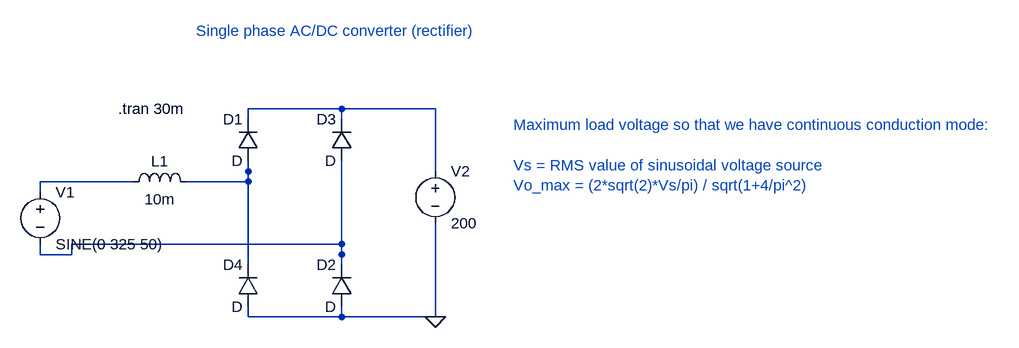
[diagram p0: schematic Single-phase-rectifier-constant-voltage-load.asc]
Single-phase-rectifier-constant-voltage-load.asc, the LTspice schematic file:
Version 4.1
SHEET 1 1420 680
WIRE 208 320 208 336
WIRE 64 320 64 336
WIRE 352 192 352 208
WIRE 208 336 64 336
WIRE 208 336 352 336
WIRE 352 336 352 208
FLAG 352 336 0
WIRE 64 32 64 16
WIRE 208 32 208 16
WIRE 352 112 352 96
WIRE 64 16 208 16
WIRE 208 16 352 16
WIRE 352 16 352 96
WIRE -112 128 -128 128
WIRE -256 144 -256 128
WIRE -128 128 -256 128
WIRE 64 96 64 112
WIRE 64 256 64 240
WIRE -32 128 -16 128
WIRE 64 112 64 128
WIRE 64 128 -16 128
WIRE 64 112 64 240
WIRE 208 256 208 240
WIRE 208 96 208 112
WIRE -256 224 -256 240
WIRE 208 240 208 112
WIRE 208 240 208 224
WIRE 208 224 -208 224
WIRE -208 224 -208 240
WIRE -208 240 -256 240
SYMBOL diode 80 96 R180
WINDOW 0 24 64 Left 2
WINDOW 3 24 0 Left 2
SYMATTR InstName D1
SYMBOL diode 224 320 R180
WINDOW 0 24 64 Left 2
WINDOW 3 24 0 Left 2
SYMATTR InstName D2
SYMBOL diode 224 96 R180
WINDOW 0 24 64 Left 2
WINDOW 3 24 0 Left 2
SYMATTR InstName D3
SYMBOL diode 80 320 R180
WINDOW 0 24 64 Left 2
WINDOW 3 24 0 Left 2
SYMATTR InstName D4
SYMBOL voltage -256 128 R0
WINDOW 123 0 0 Left 0
WINDOW 39 0 0 Left 0
SYMATTR InstName V1
SYMATTR Value SINE(0 325 50)
SYMBOL ind -128 144 R270
WINDOW 0 32 56 VTop 2
WINDOW 3 5 56 VBottom 2
SYMATTR InstName L1
SYMATTR Value 10m
SYMBOL voltage 352 96 R0
WINDOW 123 0 0 Left 0
WINDOW 39 0 0 Left 0
SYMATTR InstName V2
SYMATTR Value 200
TEXT -136 16 Left 2 !.tran 30m
TEXT 472 40 Left 2 ;Maximum load voltage so that we have continuous conduction mode: \n \nVs = RMS value of sinusoidal voltage source \nVo_max = (2*sqrt(2)*Vs/pi) / sqrt(1+4/pi^2)
TEXT -16 -104 Left 2 ;Single phase AC/DC converter (rectifier)

The netlist it stands for:
* Single-phase-rectifier-constant-voltage-load.asc
D1 N003 N001 D
D2 0 N004 D
D3 N004 N001 D
D4 0 N003 D
V1 N002 N004 SINE(0 325 50)
L1 N002 N003 10m
V2 N001 0 200
.model D D
.lib standard.dio
.tran 30m
* Maximum load voltage so that we have continuous conduction mode:
* Vs = RMS value of sinusoidal voltage source
* Vo_max = (2*sqrt(2)*Vs/pi) / sqrt(1+4/pi^2)
* Single phase AC/DC converter (rectifier)
.backanno
.end